# Altium schematic sheet LVDT.SchDoc
size A4
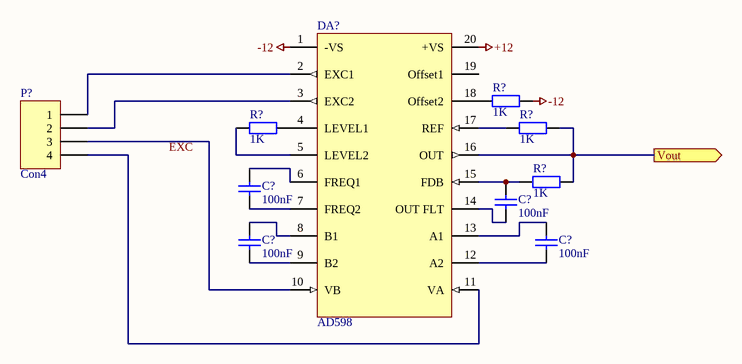
[diagram p0: LVDT.SchDoc]

## Parts
(Parts that share a designator on the sheet are numbered #1, #2 ... from top to bottom, then left to right.)
C?#1  value 100nF  [CAPC2012N]  (hidden comment: Cap)
C?#2  value 100nF  [CAPC2012N]  (hidden comment: Cap)
C?#3  value 100nF  [CAPC2012N]  (hidden comment: Cap)
C?#4  value 100nF  [CAPC2012N]  (hidden comment: Cap)
DA?  AD598  [WSOIC20]
P?  Con4  [DG125-5.0-04P]
R?#1  value 1K  [RESC2012N]  (hidden comment: Resistor)
R?#2  value 1K  [RESC2012N]  (hidden comment: Resistor)
R?#3  value 1K  [RESC2012N]  (hidden comment: Resistor)
R?#4  value 1K  [RESC2012N]  (hidden comment: Resistor)

## Ports
Vout (out)

## Nets
+12: DA?.20(+VS)
-12: DA?.1(-VS) R?#1.2
Vout: DA?.16(OUT) R?#3.2 R?#4.1 ; port Vout
NetC?#1_1: C?#1.1 DA?.6(FREQ1)
NetC?#1_2: C?#1.2 DA?.7(FREQ2)
NetC?#2_1: C?#2.1 DA?.15(FDB) R?#4.2
NetC?#2_2: C?#2.2 DA?.14(OUT_FLT)
NetC?#3_1: C?#3.1 DA?.8(B1)
NetC?#3_2: C?#3.2 DA?.9(B2)
NetC?#4_1: C?#4.1 DA?.13(A1)
NetC?#4_2: C?#4.2 DA?.12(A2)
NetDA?_2: DA?.2(EXC1) P?.1
NetDA?_3: DA?.3(EXC2) P?.2
NetDA?_4: DA?.4(LEVEL1) R?#2.2
NetDA?_5: DA?.5(LEVEL2) R?#2.1
NetDA?_10: DA?.10(VB) P?.3
NetDA?_11: DA?.11(VA) P?.4
NetDA?_17: DA?.17(REF) R?#3.1
NetDA?_18: DA?.18(Offset2) R?#1.1

Not connected (* = marked no-connect by the designer): DA? 19(Offset1)

## Notes on the sheet
- Labels drawn without touching a wire or pin: EXC

## Library data of the parts
C?#1-C?#4 = Cap: Capacitor; Published: 8-Jun-2000; LatestRevisionDate: 17-Jul-2002; LatestRevisionNote: Re-released for DXP Platform.; PackageReference: RAD-0.3; Publisher: Altium Limited
DA? = AD598: LVDT signal conditioner
R?#1-R?#4 = Resistor: Published: 8-Jun-2000; LatestRevisionDate: 17-Jul-2002; LatestRevisionNote: Re-released for DXP Platform.; PackageReference: AXIAL-0.4; Publisher: Altium Limited